# Altium schematic sheet DronePCB_1.SchDoc
size A; SheetNumber: 1; SheetTotal: 2
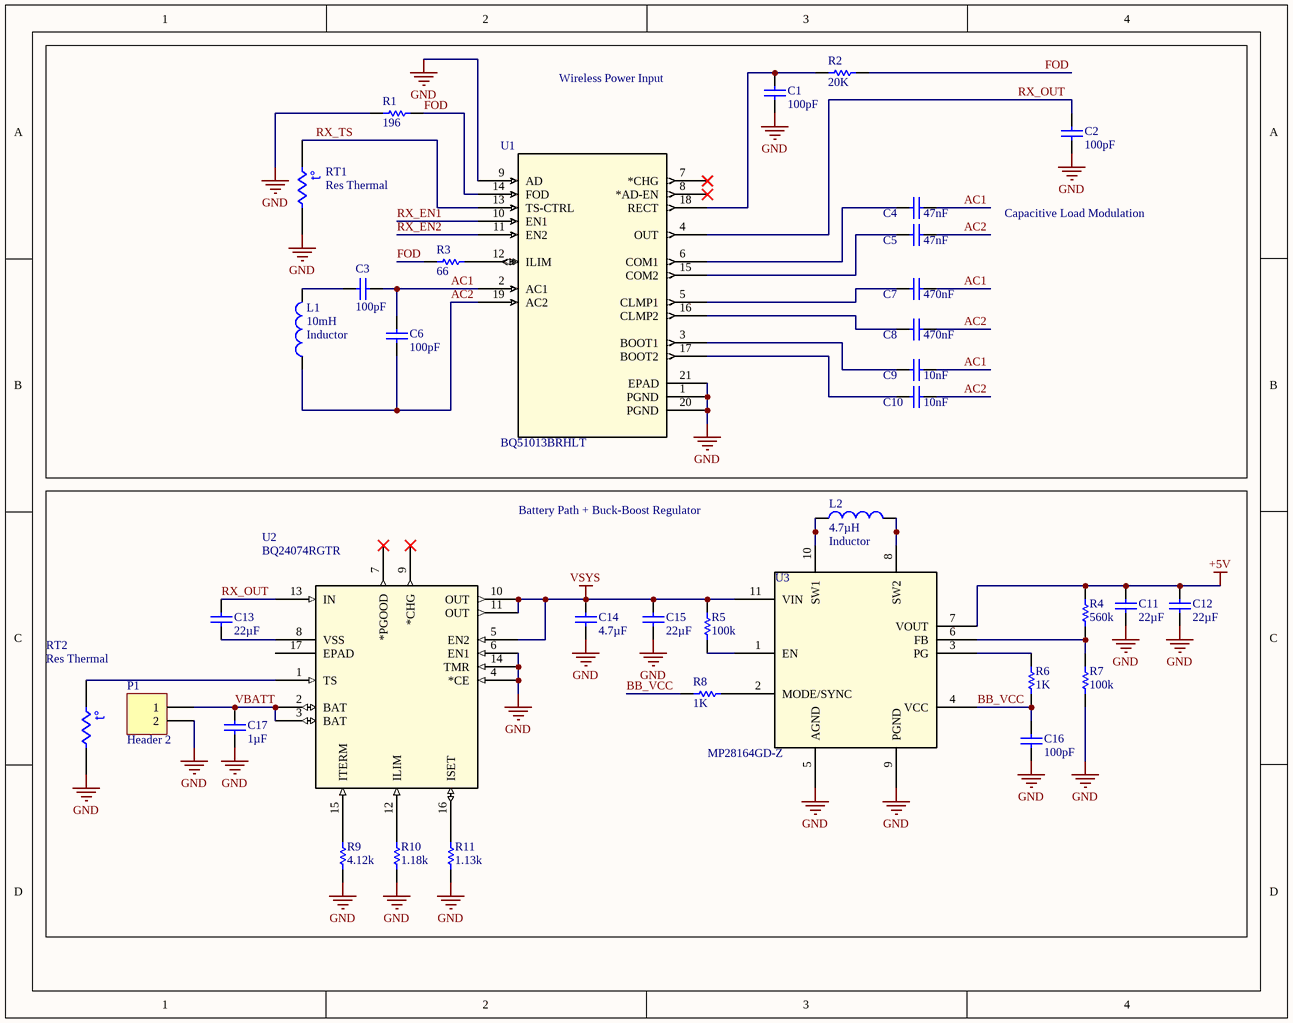
[diagram p0: DronePCB_1.SchDoc]

## Parts
C1  value 100pF  [RAD-0.3]  (hidden comment: Cap)
C2  value 100pF  [RAD-0.3]  (hidden comment: Cap)
C3  value 100pF  [RAD-0.3]  (hidden comment: Cap)
C4  value 47nF  [RAD-0.3]  (hidden comment: Cap)
C5  value 47nF  [RAD-0.3]  (hidden comment: Cap)
C6  value 100pF  [RAD-0.3]  (hidden comment: Cap)
C7  value 470nF  [RAD-0.3]  (hidden comment: Cap)
C8  value 470nF  [RAD-0.3]  (hidden comment: Cap)
C9  value 10nF  [RAD-0.3]  (hidden comment: Cap)
C10  value 10nF  [RAD-0.3]  (hidden comment: Cap)
C11  value 22µF  [RAD-0.3]  (hidden comment: Cap)
C12  value 22µF  [RAD-0.3]  (hidden comment: Cap)
C13  value 22µF  [RAD-0.3]  (hidden comment: Cap)
C14  value 4.7µF  [RAD-0.3]  (hidden comment: Cap)
C15  value 22µF  [RAD-0.3]  (hidden comment: Cap)
C16  value 100pF  [RAD-0.3]  (hidden comment: Cap)
C17  value 1µF  [RAD-0.3]  (hidden comment: Cap)
L1  Inductor  value 10mH  [0402-A]
L2  Inductor  value 4.7µH  [0402-A]
P1  Header 2  [CUI_TB002-500-02BE]
R1  value 196  [AXIAL-0.3]  (hidden comment: Res1)
R2  value 20K  [AXIAL-0.3]  (hidden comment: Res1)
R3  value 66  [AXIAL-0.3]  (hidden comment: Res1)
R4  value 560k  [AXIAL-0.3]  (hidden comment: Res1)
R5  value 100k  [AXIAL-0.3]  (hidden comment: Res1)
R6  value 1K  [AXIAL-0.3]  (hidden comment: Res1)
R7  value 100k  [AXIAL-0.3]  (hidden comment: Res1)
R8  value 1K  [AXIAL-0.3]  (hidden comment: Res1)
R9  value 4.12k  [AXIAL-0.3]  (hidden comment: Res1)
R10  value 1.18k  [AXIAL-0.3]  (hidden comment: Res1)
R11  value 1.13k  [AXIAL-0.3]  (hidden comment: Res1)
RT1  Res Thermal  [6-0805_N]
RT2  Res Thermal  [6-0805_N]
U1  BQ51013BRHLT  [RHL20_2P05X3P05]
U2  BQ24074RGTR  [RGT16_1P7X1P7]
U3  MP28164GD-Z  [QFN-11_MP28164_MNP]

## Blocks framed on the sheet
Battery Path + Buck-Boost Regulator: C11-C17 L2 P1 R4-R11 RT2 U2 U3

## Nets
+5V: C11.2 C12.2 R4.2 U3.7(VOUT)
GND: C1.2 C2.2 C11.1 C12.1 C14.1 C15.1 C16.1 C17.1 P1.2 R1.1 R7.1 R9.1 R10.1 R11.1 RT1.2 RT2.2 U1.1(PGND) U1.9(AD) U1.20(PGND) U1.21(EPAD) U2.4(*CE) U2.6(EN1) U2.14(TMR) U3.5(AGND) U3.9(PGND)
VSYS: C14.2 C15.2 R5.1 U2.5(EN2) U2.10(OUT) U2.11(OUT) U3.11(VIN)
AC1: C3.2 C4.2 C6.2 C7.2 C9.2 U1.2(AC1)
AC2: C5.2 C6.1 C8.2 C10.2 L1.1 U1.19(AC2)
BB_VCC: C16.2 R6.1 R8.2 U3.4(VCC)
FOD: R1.2 R2.2 R3.1 U1.14(FOD)
RX_EN1: U1.10(EN1)
RX_EN2: U1.11(EN2)
RX_OUT: C2.1 C13.2 U1.4(OUT) U2.13(IN)
RX_TS: RT1.1 U1.13(TS-CTRL)
VBATT: C17.2 P1.1 U2.2(BAT) U2.3(BAT)
NetC1_1: C1.1 R2.1 U1.18(RECT)
NetC3_1: C3.1 L1.2
NetC4_1: C4.1 U1.6(COM1)
NetC5_1: C5.1 U1.15(COM2)
NetC7_1: C7.1 U1.5(CLMP1)
NetC8_1: C8.1 U1.16(CLMP2)
NetC9_1: C9.1 U1.3(BOOT1)
NetC10_1: C10.1 U1.17(BOOT2)
NetC13_1: C13.1 U2.8(VSS)
NetL2_1: L2.1 U3.10(SW1)
NetL2_2: L2.2 U3.8(SW2)
NetR3_2: R3.2 U1.12(ILIM)
NetR4_1: R4.1 R7.2 U3.6(FB)
NetR5_2: R5.2 U3.1(EN)
NetR6_2: R6.2 U3.3(PG)
NetR8_1: R8.1 U3.2(MODE/SYNC)
NetR9_2: R9.2 U2.15(ITERM)
NetR10_2: R10.2 U2.12(ILIM)
NetR11_2: R11.2 U2.16(ISET)
NetRT2_1: RT2.1 U2.1(TS)

Not connected (* = marked no-connect by the designer): U1 7(*CHG)* 8(*AD-EN)*; U2 7(*PGOOD)* 9(*CHG)* 17(EPAD)

## Notes on the sheet
- Wireless Power Input
- Capacitive Load Modulation
- (in symbol Res Thermal) t°

## Library data of the parts
C1-C17 = Cap: Capacitor; Published: 8-Jun-2000; LatestRevisionDate: 17-Jul-2002; LatestRevisionNote: Re-released for DXP Platform.; PackageReference: RAD-0.3; Publisher: Altium Limited; PackageDescription: Radial Cap, Thru-Hole; 2 Leads; 0.3 in Pin Spacing
L1 L2 = Inductor: Code_IEC: 1005; Published: 8-Jun-2000; LatestRevisionDate: 29-May-2009; LatestRevisionNote: IPC-7351 Footprint Added.; PackageReference: 0402-A; Publisher: Altium Limited; PackageDescription: Chip Inductor; Code_JEITA: 0402
P1 = Header 2: Header, 2-Pin; LatestRevisionDate: 17-Jul-2002; LatestRevisionNote: Re-released for DXP Platform.; Publisher: Altium Limited
R1-R11 = Res1: Resistor; Published: 8-Jun-2000; LatestRevisionDate: 17-Jul-2002; LatestRevisionNote: Re-released for DXP Platform.; PackageReference: AXIAL-0.3; Publisher: Altium Limited; PackageDescription: Axial Device, Thru-Hole; 2 Leads; 0.3 in Pin Spacing
RT1 RT2 = Res Thermal: Thermistor; Published: 24-Mar-1999; LatestRevisionDate: 29-May-2009; LatestRevisionNote: IPC-7351 Footprint Added.; PackageVersion: Mar-2003; PackageReference: 6-0805; Publisher: Altium Limited; PackageDescription: Chip Resistor 0805 Case Size; Code_IPC: RESC2012
U1 = BQ51013BRHLT: WPC 1.1 Compatible Fully integrated Wireless power Receiver IC 20-VQFN 0 to 125; Manufacturer_Name: Texas Instruments; Copyright: Copyright (C) 2026 Ultra Librarian. All rights reserved.; Manufacturer_Part_Number: BQ51013BRHLT; RefDes: RefDes; Type: Type
U2 = BQ24074RGTR: Standalone 1-cell 1.5-A linear battery charger, Power Path, 4.2-V VBAT, 10.5-V OVP and 4.4-V VOUT 16-VQFN -40 to 85; Manufacturer_Name: Texas Instruments; Copyright: Copyright (C) 2026 Ultra Librarian. All rights reserved.; Manufacturer_Part_Number: BQ24074RGTR; RefDes: RefDes; Type: Type
U3 = MP28164GD-Z: High-Efficiency Single-Inductor Buck-Boost Converter with 4.2A Switches; Manufacturer_Name: Monolithic Power Systems; Copyright: Copyright (C) 2025 Ultra Librarian. All rights reserved.; Manufacturer_Part_Number: MP28164GD-Z; RefDes: RefDes; Type: Type